# EAGLE design torque_sensor (EAGLE 9.6.0)
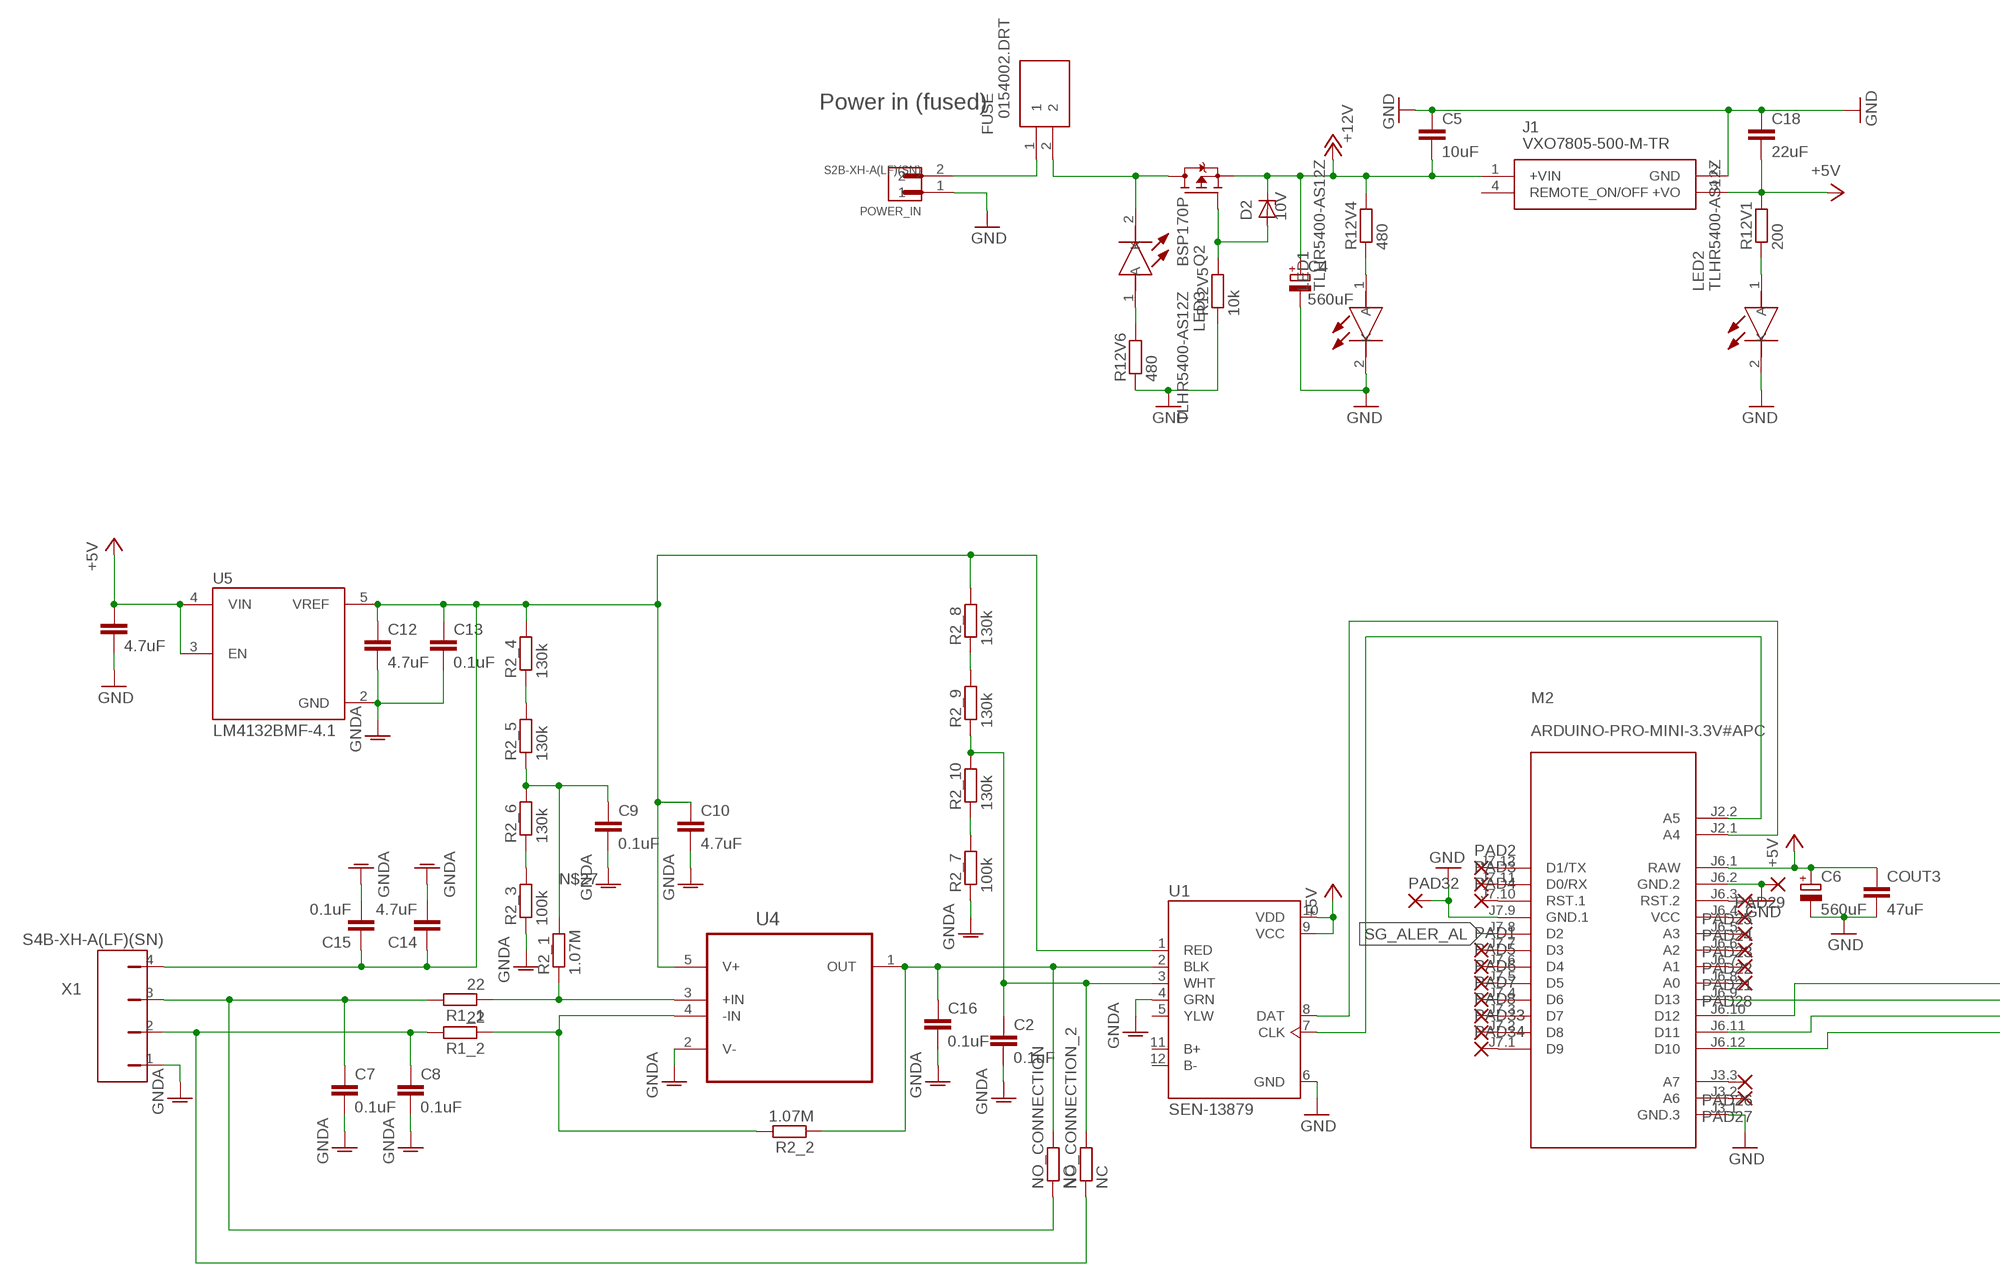
[diagram p0: schematic, sheet 1, part 1 of 2]
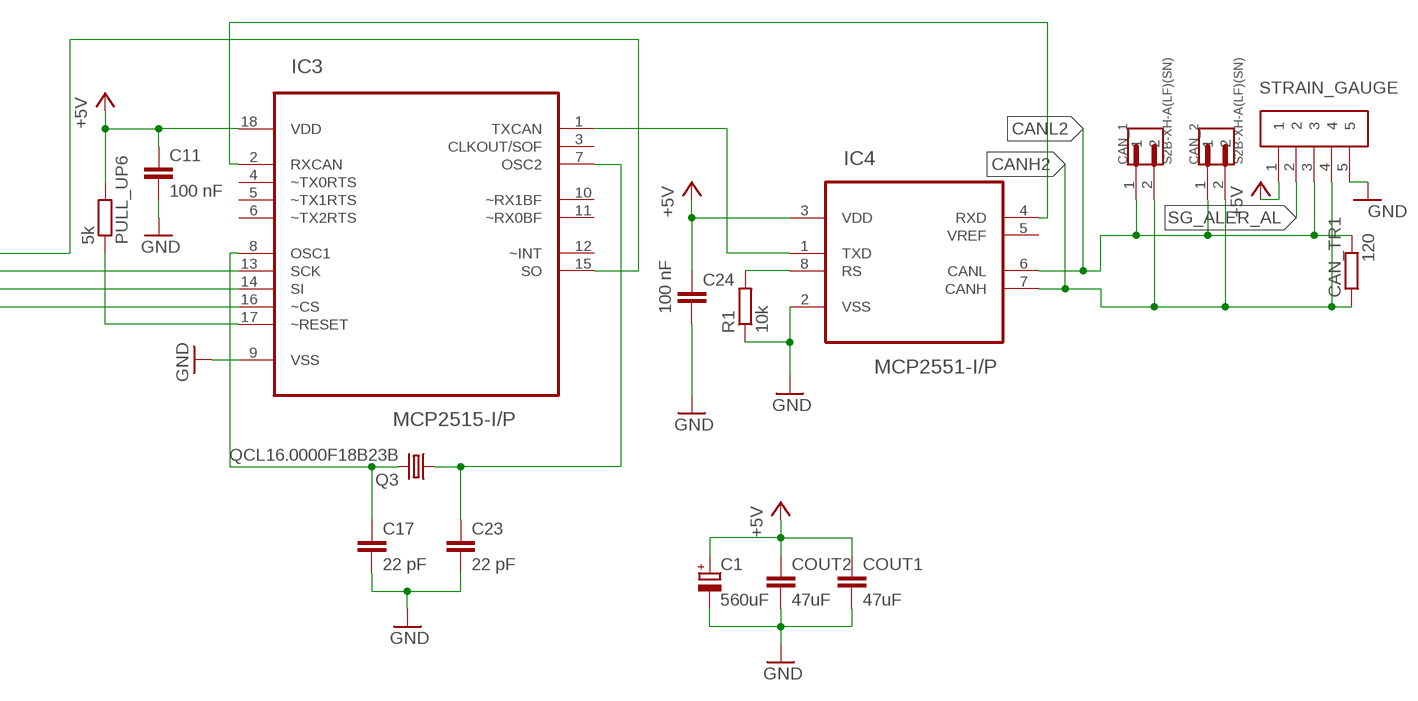
[diagram p1: schematic, sheet 1, part 2 of 2]

## Parts
C1  560uF  CPOL-EUF  [PANASONIC_F]
C2  0.1uF  C-EUC0805  [C0805]
C3  4.7uF  C-EUC0805  [C0805]
C4  560uF  CPOL-EUF  [PANASONIC_F]
C5  10uF  C-EUC0805  [C0805]
C6  560uF  CPOL-EUF  [PANASONIC_F]
C7  0.1uF  C-EUC0805  [C0805]
C8  0.1uF  C-EUC0805  [C0805]
C9  0.1uF  C-EUC0805  [C0805]
C10  4.7uF  C-EUC0805  [C0805]
C11  100 nF  C-EUC0805  [C0805]
C12  4.7uF  C-EUC0805  [C0805]
C13  0.1uF  C-EUC0805  [C0805]
C14  4.7uF  C-EUC0805  [C0805]
C15  0.1uF  C-EUC0805  [C0805]
C16  0.1uF  C-EUC0805  [C0805]
C17  22 pF  C-EUC0805  [C0805]
C18  22uF  C-EUC0805  [C0805]
C23  22 pF  C-EUC0805  [C0805]
C24  100 nF  C-EUC0805  [C0805]
CAN_1  S2B-XH-A(LF)(SN)  [JST_S2B-XH-A(LF)(SN)]
CAN_2  S2B-XH-A(LF)(SN)  [JST_S2B-XH-A(LF)(SN)]
CAN_TR1  120  R-EU_R0805  [R0805]
COUT1  47uF  C-EUC0805  [C0805]
COUT2  47uF  C-EUC0805  [C0805]
COUT3  47uF  C-EUC0805  [C0805]
D2  10V  ZENER-DIODESMB  [SMB]
FUSE  0154002.DRT  [FUSM9750X381N]
IC3  MCP2515-I/P  [DIP254P762X432-18]
IC4  MCP2551-I/P  [DIP254P762X432-8]
J1  VXO7805-500-M-TR  [VXO7805500MTR]
LED1  TLHR5400-AS12Z  [TLHR5400AS12Z]
LED2  TLHR5400-AS12Z  [TLHR5400AS12Z]
LED3  TLHR5400-AS12Z  [TLHR5400AS12Z]
M2  ARDUINO-PRO-MINI-3.3V#APC  [ARDUINO-PRO-MINI#APC]
NO_CONNECTION  NC  R-EU_R0805  [R0805]
NO_CONNECTION_2  NC  R-EU_R0805  [R0805]
PAD1  SMD2  [SMD1,27-2,54]
PAD2  SMD2  [SMD1,27-2,54]
PAD3  SMD2  [SMD1,27-2,54]
PAD4  SMD2  [SMD1,27-2,54]
PAD5  SMD2  [SMD1,27-2,54]
PAD6  SMD2  [SMD1,27-2,54]
PAD7  SMD2  [SMD1,27-2,54]
PAD8  SMD2  [SMD1,27-2,54]
PAD21  SMD2  [SMD1,27-2,54]
PAD22  SMD2  [SMD1,27-2,54]
PAD23  SMD2  [SMD1,27-2,54]
PAD24  SMD2  [SMD1,27-2,54]
PAD25  SMD2  [SMD1,27-2,54]
PAD26  SMD2  [SMD1,27-2,54]
PAD27  SMD2  [SMD1,27-2,54]
PAD28  SMD2  [SMD1,27-2,54]
PAD29  SMD2  [SMD1,27-2,54]
PAD32  SMD2  [SMD1,27-2,54]
PAD33  SMD2  [SMD1,27-2,54]
PAD34  SMD2  [SMD1,27-2,54]
POWER_IN  S2B-XH-A(LF)(SN)  [JST_S2B-XH-A(LF)(SN)]
PULL_UP6  5k  R-EU_R0805  [R0805]
Q2  BSP170P  [SOT223]
Q3  QCL16.0000F18B23B  CRYSTALHC49S  [HC49/S]
R1  10k  R-EU_R0805  [R0805]
R1_1  22  R-EU_R0805  [R0805]
R1_2  22  R-EU_R0805  [R0805]
R2_1  1.07M  R-EU_R0805  [R0805]
R2_2  1.07M  R-EU_R0805  [R0805]
R2_3  100k  R-EU_R0805  [R0805]
R2_4  130k  R-EU_R0805  [R0805]
R2_5  130k  R-EU_R0805  [R0805]
R2_6  130k  R-EU_R0805  [R0805]
R2_7  100k  R-EU_R0805  [R0805]
R2_8  130k  R-EU_R0805  [R0805]
R2_9  130k  R-EU_R0805  [R0805]
R2_10  130k  R-EU_R0805  [R0805]
R12V1  200  R-EU_R0805  [R0805]
R12V4  480  R-EU_R0805  [R0805]
R12V5  10k  R-EU_R0805  [R0805]
R12V6  480  R-EU_R0805  [R0805]
STRAIN_GAUGE  S5B-XH-A(LF)(SN)  [JST_S5B-XH-A(LF)(SN)]
U1  SEN-13879  [SPARKFUN_SEN-13879]
U4  LMP7731MF  [SOT95P284X119-5N]
U5  LM4132BMF-4.1  [SOT95P280X145-5N]
X1  S4B-XH-A(LF)(SN)  [S4B-XH-A(LF)(SN)]

## Nets
+5V [signal]: C1.+ C3.1 C6.+ C11.1 C18.2 C24.1 COUT1.1 COUT2.1 COUT3.1 IC3.18(VDD) IC4.3(VDD) J1.3(+VO) M2.J6.1(RAW) PULL_UP6.2 R12V1.2 STRAIN_GAUGE.1 U1.9(VCC) U1.10(VDD) U5.3(EN) U5.4(VIN)
+12V: C4.+ C5.2 D2.C J1.1(+VIN) Q2.3(S) R12V4.2
CANH2: CAN_1.2 CAN_2.2 CAN_TR1.1 IC4.7(CANH) STRAIN_GAUGE.4
CANL2: CAN_1.1 CAN_2.1 CAN_TR1.2 IC4.6(CANL) STRAIN_GAUGE.3
GND: C1.- C3.2 C4.- C5.1 C6.- C11.2 C17.2 C18.1 C23.2 C24.2 COUT1.2 COUT2.2 COUT3.2 IC3.9(VSS) IC4.2(VSS) J1.2(GND) LED1.2(K) LED2.2(K) M2.J3.1(GND.3) M2.J6.2(GND.2) M2.J7.9(GND.1) PAD29.1(P) PAD32.1(P) POWER_IN.1 R1.1 R12V5.1 R12V6.1 STRAIN_GAUGE.5 U1.6(GND)
GNDA: C2.2 C7.2 C8.2 C9.2 C10.2 C12.2 C13.2 C14.2 C15.2 C16.2 R2_3.1 R2_7.1 U1.4(GRN) U4.2(V-) U5.2(GND) X1.1
N$1: R2_8.1 R2_9.2
N$2: LED2.1(A) R12V1.1
N$3: LED1.1(A) R12V4.1
N$4: C16.1 NO_CONNECTION.2 R2_2.1 U1.2(BLK) U4.1(OUT)
N$5: R1_2.1 R2_2.2 U4.4(-IN)
N$6: M2.J7.12(D1/TX) PAD2.1(P)
N$7: D2.A Q2.1(G) R12V5.2
N$8: R2_7.2 R2_10.1
N$9: C10.1 C12.1 C13.1 C14.1 C15.1 R2_4.2 R2_8.2 U1.1(RED) U4.5(V+) U5.5(VREF) X1.4
N$11: M2.J7.7(D3) PAD1.1(P)
N$12: M2.J7.6(D4) PAD5.1(P)
N$13: M2.J7.5(D5) PAD6.1(P)
N$14: M2.J7.4(D6) PAD7.1(P)
N$15: R1_1.1 R2_1.1 U4.3(+IN)
N$16: LED3.1(A) R12V6.2
N$17: M2.J2.2(A5) U1.7(CLK)
N$18: M2.J7.3(D7) PAD8.1(P)
N$19: M2.J7.11(D0/RX) PAD3.1(P)
N$20: C2.1 NO_CONNECTION_2.2 R2_9.1 R2_10.2 U1.3(WHT)
N$21: M2.J2.1(A4) U1.8(DAT)
N$22: FUSE.1 POWER_IN.2
N$23: M2.J7.10(RST.1) PAD4.1(P)
N$24: FUSE.2 LED3.2(K) Q2.2(D) Q2.4(D)
N$25: M2.J6.7(A1) PAD21.1(P)
N$26: M2.J6.6(A2) PAD22.1(P)
N$27: C9.1 R2_1.2 R2_5.1 R2_6.2
N$28: M2.J6.5(A3) PAD23.1(P)
N$29: M2.J6.4(VCC) PAD24.1(P)
N$30: M2.J6.3(RST.2) PAD25.1(P)
N$31: M2.J3.3(A7) PAD26.1(P)
N$32: C8.1 NO_CONNECTION_2.1 R1_2.2 X1.2
N$34: M2.J7.2(D8) PAD33.1(P)
N$35: R2_4.1 R2_5.2
N$36: IC3.15(SO) M2.J6.10(D12)
N$37: IC3.13(SCK) M2.J6.9(D13)
N$38: IC3.14(SI) M2.J6.11(D11)
N$39: IC3.16(~CS) M2.J6.12(D10)
N$40: M2.J3.2(A6) PAD27.1(P)
N$41: M2.J6.8(A0) PAD28.1(P)
N$54: R2_3.2 R2_6.1
N$55: M2.J7.1(D9) PAD34.1(P)
N$56: IC3.17(~RESET) PULL_UP6.1
N$58: C17.1 IC3.8(OSC1) Q3.2
N$59: C23.1 IC3.7(OSC2) Q3.1
N$60: IC4.8(RS) R1.2
N$62: IC3.2(RXCAN) IC4.4(RXD)
N$68: IC3.1(TXCAN) IC4.1(TXD)
SG_ALER_AL: M2.J7.8(D2) STRAIN_GAUGE.2
VCCINT4: C7.1 NO_CONNECTION.1 R1_1.2 X1.3
Unconnected: IC3.3(CLKOUT/SOF) IC3.4(~TX0RTS) IC3.5(~TX1RTS) IC3.6(~TX2RTS) IC3.10(~RX1BF) IC3.11(~RX0BF) IC3.12(~INT) IC4.5(VREF) J1.4(REMOTE_ON/OFF) U1.5(YLW) U1.11(B+) U1.12(B-)

## Notes on the sheet
- Power in (fused)

## Library data of the parts
C1 C4 C6 = rcl:CPOL-EU: POLARIZED CAPACITOR, European symbol; SPICEPREFIX: C
C2 C3 C5 C7-C18 C23 C24 COUT1-COUT3 = rcl:C-EU: CAPACITOR, European symbol; SPICEPREFIX: C
CAN_1 CAN_2 POWER_IN = S2B-XH-A_LF__SN_:S2B-XH-A(LF)(SN): XH Series 2.5mm 2 Position Through Hole Shrouded Header Connector; DESCRIPTION: Connector Header Through Hole, Right Angle 2 position 0.098 _2.50mm_; DIGI-KEY_PART_NUMBER: 455-2257-ND; DIGI-KEY_PURCHASE_URL: https://www.digikey.com/product-detail/en/jst-sales-america-inc/S2B-XH-A_LF__SN_/455-2257-ND/1651055?utm_source=snapeda&utm_medium=aggregator&utm_campaign=symbol; MF: JST Sales; MP: S2B-XH-A_LF__SN_; PACKAGE: None
CAN_TR1 NO_CONNECTION NO_CONNECTION_2 PULL_UP6 R1 R1_1 R1_2 R2_1-R2_10 R12V1 R12V4-R12V6 = rcl:R-EU_: RESISTOR, European symbol; SPICEPREFIX: R
D2 = diode:ZENER-DIODE: Z-Diode
FUSE = 0154002.DRT:0154002.DRT: Littelfuse 2A T Surface Mount Fuse, 125V ac/dc Source: Datasheet; DESCRIPTION: Littelfuse 2A T Surface Mount Fuse, 125V ac/dc; HEIGHT: 3.81mm; MANUFACTURER_NAME: LITTELFUSE; MANUFACTURER_PART_NUMBER: 0154002.DRT; MOUSER_PART_NUMBER: 576-0154002.DRT; MOUSER_PRICE-STOCK: https://www.mouser.co.uk/ProductDetail/Littelfuse/0154002DRT?qs=2VFNtWizgicDQ8R7JxIsmA%3D%3D
IC3 = MCP2515-I_P:MCP2515-I/P: Stand-Alone CAN Controller; AVAILABILITY: Unavailable; DESCRIPTION: MCP2515 Series 5.5 V 1 Mb/s Stand Alone SPI Interface CAN Controller - PDIP-18; MF: Microchip; MP: MCP2515-I/P; PACKAGE: DIP-18 Microchip; PRICE: None
IC4 = MCP2551-I_P:MCP2551-I/P: High-Speed CAN Transceiver; AVAILABILITY: Unavailable; DESCRIPTION: MCP2551 Series 5.5 V 1 Mb/s Surface Mount High-Speed CAN Transceiver - PDIP-8; MF: Microchip; MP: MCP2551-I/P; PACKAGE: DIP-8 Microchip; PRICE: None
J1 = VXO7805-500-M-TR:VXO7805-500-M-TR: Module DC-DC 24VIN 1-OUT 5V 0.5A 2.5W 4-Pin SMD Module T/R Source: Datasheet; DESCRIPTION: Module DC-DC 24VIN 1-OUT 5V 0.5A 2.5W 4-Pin SMD Module T/R; HEIGHT: 3.5mm; MANUFACTURER_NAME: CUI Inc; MANUFACTURER_PART_NUMBER: VXO7805-500-M-TR; MOUSER_PART_NUMBER: 490-VXO7805-500-M-TR; MOUSER_PRICE-STOCK: https://www.mouser.co.uk/ProductDetail/CUI-Inc/VXO7805-500-M-TR?qs=GBLSl2AkirsIOUn2Flq1hQ%3D%3D
LED1-LED3 = SamacSys_Parts:TLHR5400-AS12Z: Standard LEDs - Through Hole Red 10mcd; 5mm 612-625nm; 2V Typ Source: Datasheet <http://www.vishay.com/docs/83012/tlhg540.pdf>; DESCRIPTION: Standard LEDs - Through Hole Red 10mcd; 5mm 612-625nm; 2V Typ; HEIGHT: 12.8mm; MANUFACTURER_NAME: Vishay; MANUFACTURER_PART_NUMBER: TLHR5400-AS12Z; MOUSER_PART_NUMBER: 78-TLHR5400-AS12Z; MOUSER_PRICE-STOCK: https://www.mouser.co.uk/ProductDetail/Vishay-Semiconductors/TLHR5400-AS12Z?qs=nQ9vpdMXC6Dc4iRzpr4t7Q%3D%3D
M2 = diy-modules:ARDUINO-PRO-MINI-*#APC: Arduino Pro Mini (and compatible devices) with angle programming connector More details available here: https://www.arduino.cc/en/Main/ArduinoBoardProMini Click here to find device on ebay.com <http://www.ebay.com/sch/arduino+pro+mini>
PAD1-PAD8 PAD21-PAD29 PAD32-PAD34 = wirepad:SMD2: SMD PAD
Q2 = transistor-fet:BSP170P: SIPMOS(R) Small-Signal-Transistor P-Channel, Enhancement mode Source: http://www.infineon.com/upload/Document/BSP170P_Rev2.4.pdf
Q3 = adafruit:CRYSTAL: CRYSTAL; OC_FARNELL: 1667008; OC_NEWARK: unknown
STRAIN_GAUGE = S5B-XH-A_LF__SN_:S5B-XH-A(LF)(SN): XH Connector 2.5mm pitch/Disconnectable Crimp Style Connector; AVAILABILITY: Unavailable; DESCRIPTION: Connector Header Through Hole, Right Angle 5 position 0.098 _2.50mm_; MF: JST Sales; MP: S5B-XH-A_LF__SN_; PACKAGE: None; PRICE: None
U1 = SEN-13879:SEN-13879: Load Cell Amp Hx711; DESCRIPTION: External Input Sensor Amplifier; DIGI-KEY_PART_NUMBER: 1568-1436-ND; DIGI-KEY_PURCHASE_URL: https://www.digikey.com/product-detail/en/sparkfun-electronics/SEN-13879/1568-1436-ND/6202732?utm_source=snapeda&utm_medium=aggregator&utm_campaign=symbol; MF: SparkFun; MP: SEN-13879; PACKAGE: None
U4 = LMP7731MF:LMP7731MF: Amplifier; AVAILABILITY: Unavailable; DESCRIPTION: Ic Amp Prec Rrio Ln Sgl Sot23-5 - Lmp7731mf/Nopb; MF: Texas Instruments; MP: LMP7731MF; PACKAGE: SOT-23 Texas Instruments; PRICE: None
U5 = LM4132BMF-4.1:LM4132BMF-4.1: Voltage Reference, Precision, Low Dropout, Series - Fixed, LM4132 Series, 4.096V, SOT-23-5; AVAILABILITY: Unavailable; DESCRIPTION: Series Voltage Reference IC ±0.1% SOT-23-5; MF: Texas Instruments; MP: LM4132BMF-4.1; PACKAGE: SOT-23 Texas Instruments; PRICE: None
X1 = S4B-XH-A_LF__SN_:S4B-XH-A(LF)(SN): http://octopart.com/s4b-xh-a%28lf%29%28sn%29-jst-7995347; AVAILABILITY: Unavailable; DESCRIPTION: Connector Header Through Hole, Right Angle 4 position 0.098 _2.50mm_; MF: JST Sales; MP: S4B-XH-A_LF__SN_; PACKAGE: None; PRICE: None

## Net classes
1 signal: width 0.3 mm, drill 0.4 mm, clearance 0.25 mm
2 12V: width 1 mm, drill 1.1 mm, clearance 0.25 mm

## Board
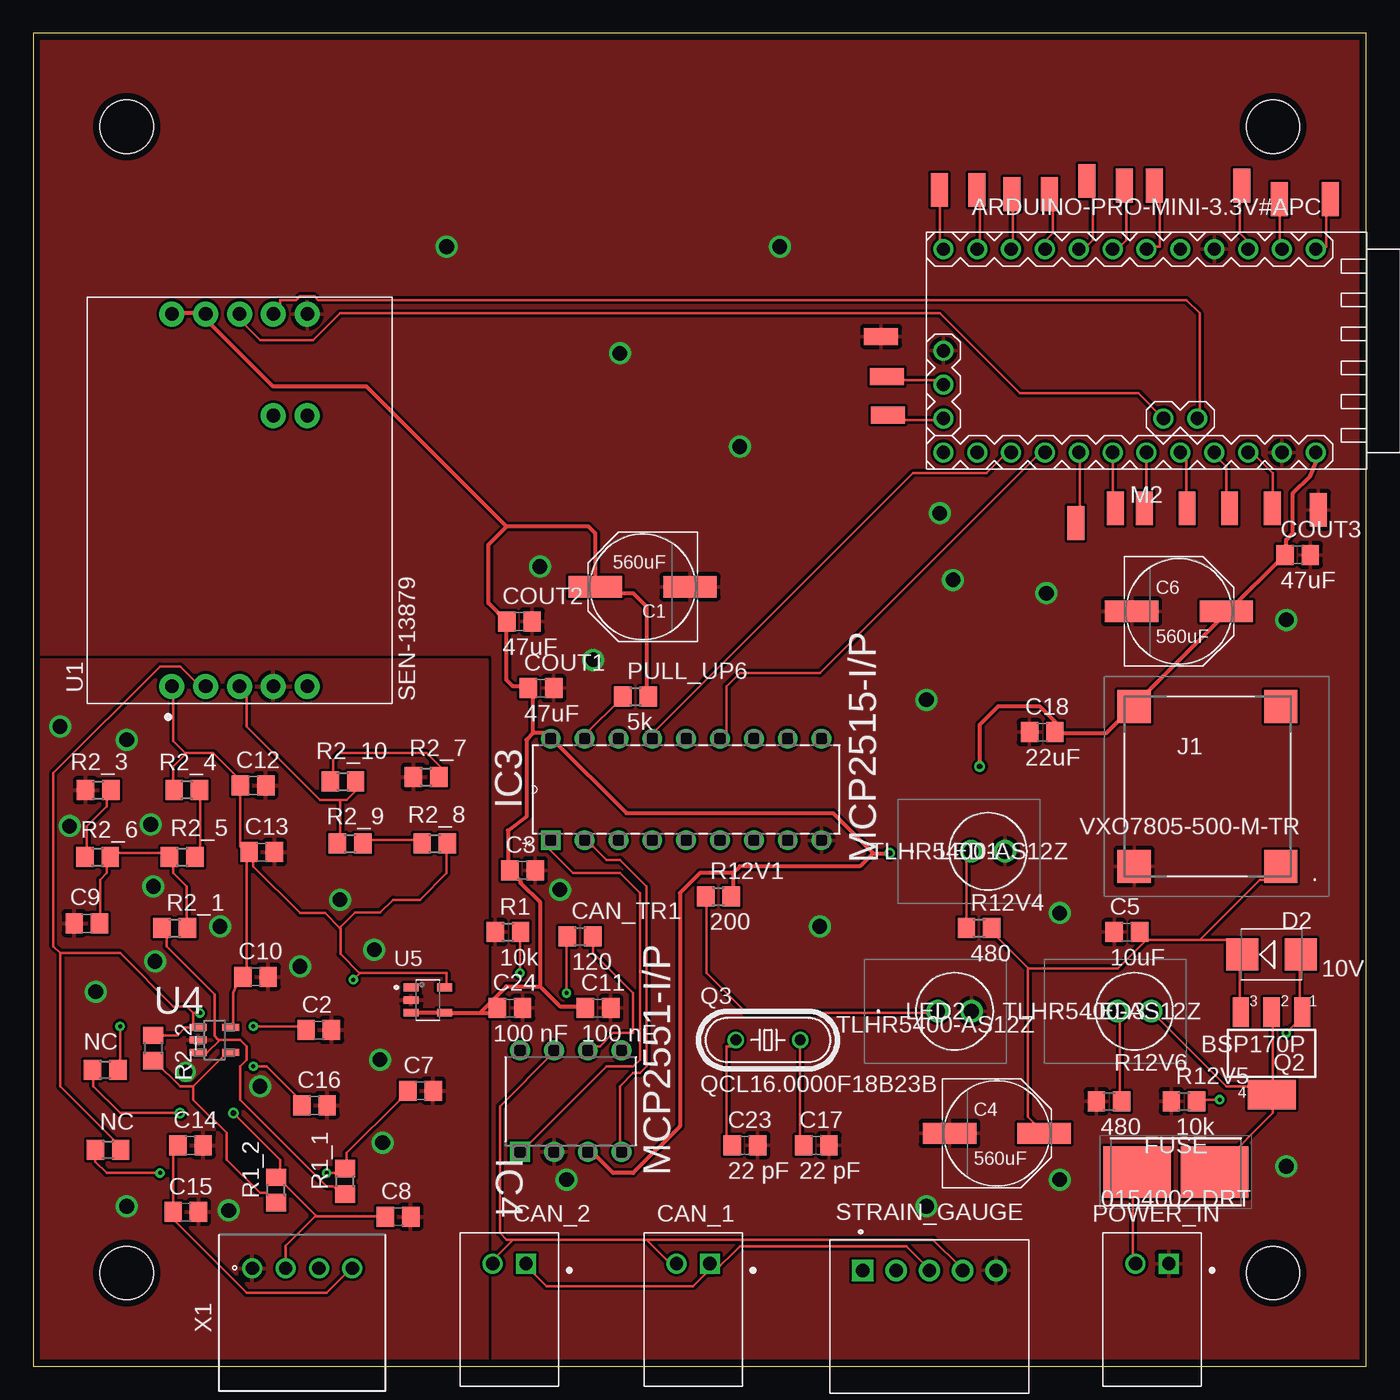
[diagram p2: board, top side]
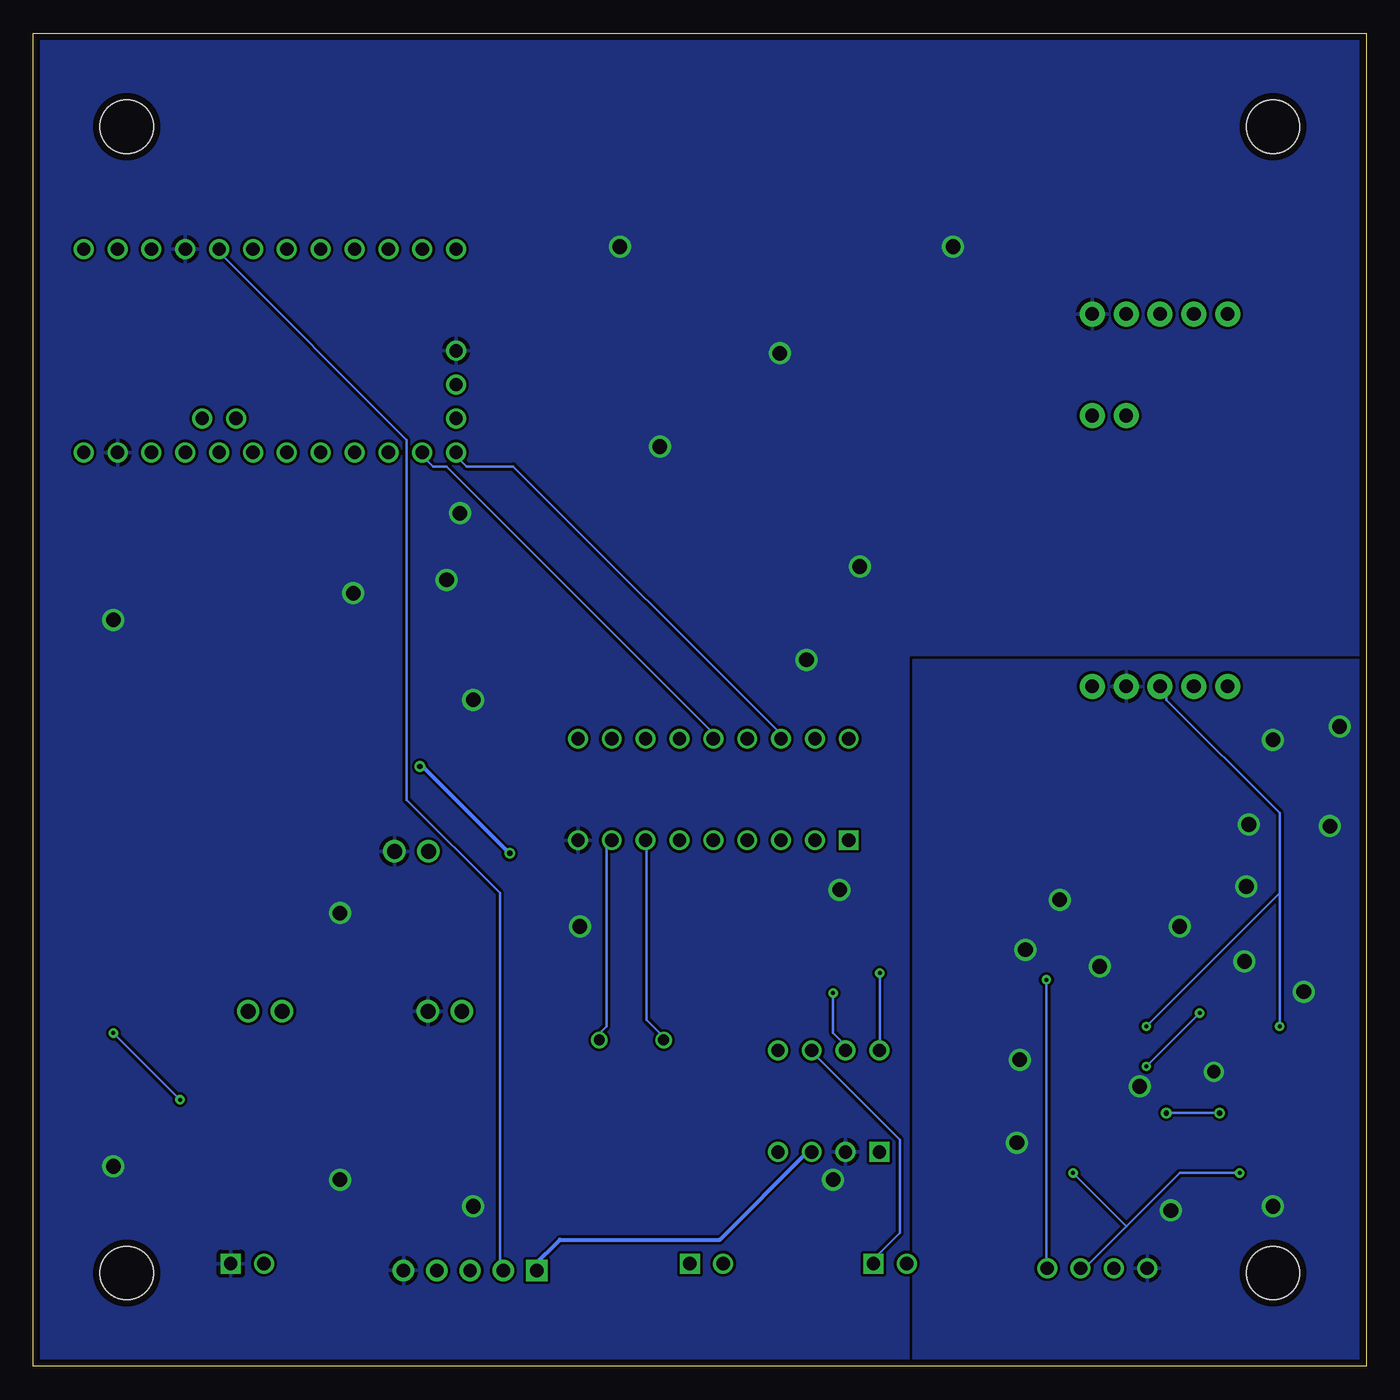
[diagram p3: board, bottom side, seen from below]

Size 100 x 100 mm. Coordinates in mm from the lower left corner, seen from the top.
Outline: 0,0 100,0 100,100 0,100 0,0
Copper layers (1*16): Top 0.035mm / dielectric 1.5mm / Bottom 0.035mm
Design rules "JLC_Vermilion2020": minimum track width 0.2mm, minimum drill 0.3mm, track to track 0.2mm, track to pad 0.3mm, pad to pad 0.3mm, via to via 0.2mm, smd to smd 0.2mm, copper to edge 0.5mm, drill to drill 0.25mm, minimum pad ring 0.2mm, minimum via ring 0.2mm, stop-mask expansion 0.055mm, vias tented up to drill 0.3mm, thermal gap 0.3mm
Holes 4 mm at 7,7 93,7 93,93 7,93

### Footprints (pad centres in the part's own frame; a part is rotated, then mirrored left to right if it is on the bottom)
PANASONIC_F = smd 4 x 1.6: + 3.55,0; - -3.55,0
C0805 = smd 1.3 x 1.5: 1 -0.95,0; 2 0.95,0
JST_S2B-XH-A(LF)(SN) = drill 1 square: 1 -1.25,0 | drill 1: 2 1.25,0
R0805 = smd 1.3 x 1.5: 1 -0.95,0; 2 0.95,0
SMB = smd 2.4 x 2.4: A 2.2,0; C -2.2,0
FUSM9750X381N = smd 5.05 x 3.85: 1 -2.9,0; 2 2.9,0
DIP254P762X432-18 = drill 0.991 square: 1 -7.62,20.32 | drill 0.991: 2 -7.62,17.78; 3 -7.62,15.24; 4 -7.62,12.7; 5 -7.62,10.16; 6 -7.62,7.62; 7 -7.62,5.08; 8 -7.62,2.54; 9 -7.62,0; 10 0,0; 11 0,2.54; 12 0,5.08; 13 0,7.62; 14 0,10.16; 15 0,12.7; 16 0,15.24; 17 0,17.78; 18 0,20.32
DIP254P762X432-8 = drill 0.991 square: 1 -7.62,7.62 | drill 0.991: 2 -7.62,5.08; 3 -7.62,2.54; 4 -7.62,0; 5 0,0; 6 0,2.54; 7 0,5.08; 8 0,7.62
VXO7805500MTR = smd 2.5 x 2.5: 1 -5.5,6; 2 5.5,6; 3 5.5,-6; 4 -5.5,-6
TLHR5400AS12Z = drill 1.12 pad 1.68: 1 0,0; 2 2.54,0
ARDUINO-PRO-MINI#APC = drill 1: J2.1 -1.27,5.08; J2.2 -3.81,5.08; J3.1 15.24,0; J3.2 15.24,2.54; J3.3 15.24,5.08; J6.1 -12.7,7.62; J6.2 -10.16,7.62; J6.3 -7.62,7.62; J6.4 -5.08,7.62; J6.5 -2.54,7.62; J6.6 0,7.62; J6.7 2.54,7.62; J6.8 5.08,7.62; J6.9 7.62,7.62; J6.10 10.16,7.62; J6.11 12.7,7.62; J6.12 15.24,7.62; J7.1 15.24,-7.62; J7.2 12.7,-7.62; J7.3 10.16,-7.62; J7.4 7.62,-7.62; J7.5 5.08,-7.62; J7.6 2.54,-7.62; J7.7 0,-7.62; J7.8 -2.54,-7.62; J7.9 -5.08,-7.62; J7.10 -7.62,-7.62; J7.11 -10.16,-7.62; J7.12 -12.7,-7.62
SMD1,27-2,54 = smd 1.27 x 2.54: 1 0,0
SOT223 = smd 1.219 x 2.235: 1 -2.311,-3.099; 2 0,-3.099; 3 2.311,-3.099 | smd 3.6 x 2.2: 4 0,3.099
HC49/S = drill 0.813: 1 -2.413,0; 2 2.413,0
JST_S5B-XH-A(LF)(SN) = drill 1 pad 1.59 square: 1 -5,0 | drill 1 pad 1.59: 2 -2.5,0; 3 0,0; 4 2.5,0; 5 5,0
SPARKFUN_SEN-13879 = drill 1.016 pad 1.88: 1 -13.97,5.08; 2 -13.97,2.54; 3 -13.97,0; 4 -13.97,-2.54; 5 -13.97,-5.08; 6 13.97,-5.08; 7 13.97,-2.54; 8 13.97,0; 9 13.97,2.54; 10 13.97,5.08; 11 6.35,-2.54; 12 6.35,-5.08
SOT95P284X119-5N = smd 1.27 x 0.533: 1 -1.219,0.94; 2 -1.219,0; 3 -1.219,-0.94; 4 1.219,-0.94; 5 1.219,0.94
SOT95P280X145-5N = smd 1.21 x 0.59: 1 -1.255,0.95; 2 -1.255,0; 3 -1.255,-0.95; 4 1.255,-0.95; 5 1.255,0.95
S4B-XH-A(LF)(SN) = drill 1: 1 -0.02,3.75; 2 -0.02,1.25; 3 -0.02,-1.25; 4 -0.02,-3.75

### Placement (x,y rotation side)
C1  45.72,58.47 180 top
C2  21.42,25.22 0 top
C3  36.7,37.2 0 top
C4  72.29,17.47 0 top
C5  82.04,32.57 0 top
C6  85.95,56.63 0 top
C7  29.06,20.67 0 top
C8  27.37,11.22 0 top
C9  4.02,33.22 180 top
C10  16.67,29.22 0 top
C11  42.37,26.87 0 top
C12  16.49,43.57 0 top
C13  17.14,38.57 0 top
C14  11.79,16.57 0 top
C15  11.44,11.57 0 top
C16  21.09,19.57 0 top
C17  58.74,16.57 0 top
C18  75.69,47.57 0 top
C23  53.39,16.57 0 top
C24  35.75,26.87 0 top
CAN_1  49.5,7.69 180 top
CAN_2  35.72,7.69 180 top
CAN_TR1  41.02,32.25 0 top
COUT1  38.09,50.87 0 top
COUT2  36.47,55.87 0 top
COUT3  94.85,60.87 0 top
D2  92.9,30.89 0 top
FUSE  85.72,14.57 0 top
IC3  59.14,47.08 90 top
IC4  44.14,23.69 90 top
J1  88.09,43.5 180 top
LED1  70.36,38.63 0 top
LED2  67.85,26.63 0 top
LED3  81.34,26.63 0 top
M2  83.52,76.18 180 top
NO_CONNECTION  5.61,16.25 0 top
NO_CONNECTION_2  5.39,22.25 0 top
PAD1  84.1,88.57 0 top
PAD2  97.29,87.57 0 top
PAD3  93.48,87.57 0 top
PAD4  90.67,88.57 0 top
PAD5  81.86,88.57 0 top
PAD6  79.03,88.92 0 top
PAD7  76.22,87.92 0 top
PAD8  73.41,87.92 0 top
PAD21  81.18,64.36 0 top
PAD22  83.37,64.36 0 top
PAD23  86.56,64.36 0 top
PAD24  89.75,64.36 0 top
PAD25  92.94,64.36 0 top
PAD26  64.13,71.36 90 top
PAD27  64.03,74.25 90 top
PAD28  78.22,63.25 0 top
PAD29  96.41,64.25 0 top
PAD32  63.6,77.25 90 top
PAD33  70.79,88.25 0 top
PAD34  67.98,88.25 0 top
POWER_IN  83.94,7.69 180 top
PULL_UP6  45.18,50.25 0 top
Q2  92.9,23.47 180 top
Q3  55.12,24.47 0 top
R1  35.61,32.57 0 top
R1_1  23.4,13.87 90 top
R1_2  18.22,13.22 90 top
R2_1  10.61,32.87 0 top
R2_2  8.99,23.87 270 top
R2_3  4.87,43.22 0 top
R2_4  11.52,43.22 180 top
R2_5  11.17,38.22 0 top
R2_6  4.82,38.22 0 top
R2_7  29.47,44.22 0 top
R2_8  30.12,39.22 0 top
R2_9  23.77,39.22 0 top
R2_10  23.23,43.87 0 top
R12V1  51.4,35.25 0 top
R12V4  70.95,32.87 0 top
R12V5  86.33,19.87 0 top
R12V6  80.71,19.87 0 top
STRAIN_GAUGE  67.23,7.18 0 top
U1  15.47,64.97 90 top
U4  13.6,24.47 0 top
U5  29.61,27.47 0 top
X1  20.18,7.37 90 top

### Tracks (layer width: path | path; a pad name or v marks a point on that pad's centre or on a via)
+5V  (via drill 0.4)
  Top 0.3: U5.3 28.5,26.5 30.5,26.5 U5.4 31,26.5 33.5,26.5 | 33.5,26.5 34.5,26.5 C24.1 | 38,28.5 39.5,27 41,27 C11.1 | 38,28.5 35.5,28.5 33.5,26.5 | 37.5,47.5 37.5,50.5 COUT1.1 37,51 36,51 35.5,51.5 35.5,55.5 COUT2.1 34.14,57.25 34.14,61.63 35.5,63 | 37.5,47.5 38.5,47.5 IC3.18 39,47 44.5,41.5 60,41.5 63,38.5 62.98,38.48 | U1.10 10.5,79 12.5,79 U1.9 13,78.5 18,73.5 25,73.5 35.5,63 | PULL_UP6.2 46,50.5 46,57 45,58 42.5,58 C1.+ 42.17,62.47 41.64,63 35.5,63 | 37.5,47.5 37,47 37,41.23 35.61,40.2 35.61,37.35 C3.1 36.55,36.4 36.55,36.27 38,34.82 38,28.5 | M2.J6.1 96.5,68.5 95.79,66.79 94.5,65.5 94.5,62.5 94,62 94,61 COUT3.1 93.5,60.5 90,57 89.5,57 C6.+ 89.5,56.5 82.5,49.5 | 52.5,37 53,37.5 62,37.5 62.98,38.48 | 52.5,37 52.5,35.5 R12V1.2 | 82.5,49.5 80.5,47.5 77,47.5 C18.2 77,48 75.47,49.53 72.39,49.53 71,48.14 v71,45 | 82.5,49.5 J1.3 | 52.5,37 50,37 48.5,35.5 48.5,18 45,14.5 43.5,14.5 42,16 IC4.3 | 62.98,38.48 v64.26,38.48
  Bottom 0.3: IC4.3 42,16 48.5,9.5 60.5,9.5 62.5,7.5 STRAIN_GAUGE.1 | v64.26,38.48 70.78,45 v71,45
+12V
  Top 0.2: 83.5,32 83,32.5 C5.2 83.5,32 | 87.5,32 89.5,32 90.5,31 D2.C 90.5,30.5 90.5,27 Q2.3 | 87.5,32 83.5,32 | 74.6,29.86 81.36,29.86 83.5,32 | 74.6,29.86 74.6,29.9 72,32.5 R12V4.2 | 87.5,32 92,36.5 92.5,36.5 93.5,37.5 J1.1 | 74.6,29.86 74.6,18.71 C4.+
CANH2  (via drill 0.3)
  Top 0.2: v40,28 40,32 CAN_TR1.1 | 36,9.5 34.5,8 CAN_2.2 | 46,9.5 36,9.5 | 46,9.5 47.5,8 48,8 CAN_1.2 | 46,9.5 67.5,9.5 69.5,7.5 STRAIN_GAUGE.4 | 36,9.5 35.5,9.5 35,10 35,19.5 39,23.5 IC4.7
  Bottom 0.2: v40,28 40,25 39,24 IC4.7
CANL2
  Top 0.2: CAN_TR1.2 42,32 42,31 45,28 45,25 43.5,25 42.5,24 42,24 IC4.6 | 50.5,7 51,7.5 CAN_1.1 50.5,7 | 50.5,7 49.5,6 38.5,6 37,7.5 CAN_2.1 | 50.5,7 51,7 53,9 65.5,9 67,7.5 STRAIN_GAUGE.3
  Bottom 0.2: IC4.6 41.5,23.5 35,17 35,10 37,8 CAN_2.1
GND  (via drill 1.1)
  other vias: 40,14 67,12 77,14 94,15 39.51,35.75 59,33 77,34 67,50 94,56 76,58 69,59 68,64 42,53 38,60 53,69 44,76 56,84 31,84
  pour Top (rank 2): -2,102 -2,-3 -3,-4 107,-4 108,-5 108,104 104,108 4,108
  pour Bottom (rank 2): -2,106 -2,-6 0,-8 104,-8 107,-5 108,-4 108,106
GNDA  (via drill 1, 1.1)
  other vias: 2,48 7,47 23,35 25.57,31.24 9,36 14,33 9.13,30.36 20,30 26,23 4.68,28.1 2.71,40.51 8.81,40.64 17,21 26.21,16.76 14.65,11.68 7,12 11.43,22.1
  pour Bottom: -3,53 34,53 34,-7 -8,-7 -13,-2 -13,43
  pour Top: -3,53 34,53 34,-2 33,-3 -2,-3 -4,-1 -4,52
N$1
  Top 0.2: R2_9.2 25,39.5 29,39.5 R2_8.1
N$2
  Top 0.2: R12V1.1 50.5,35 50.5,29.5 53.5,26.5 67.5,26.5 LED2.1
N$3
  Top 0.2: R12V4.1 70,38.5 LED1.1
N$4  (via drill 0.3)
  Top 0.2: 12,26.5 11.5,27 10.5,27 6.5,31 2,31 | 12,26.5 12,25.5 U4.1 11.41,25.41 10.82,24.82 R2_2.1 | 2,31 2,21 6.5,16.5 NO_CONNECTION.2 | v16.5,22.5 17.5,22.5 20,20 C16.1 | 12,26.5 v12.5,26.5 | 2,31 1.5,31.5 1.5,44.5 9.5,52.5 11,52.5 12.5,51 U1.2
  Bottom 0.2: v12.5,26.5 v16.5,22.5
N$5
  Top 0.2: R1_2.1 18,12.5 17.5,13 17,13 14.5,15.5 14.5,17.5 12,20 12,21 | R2_2.2 9.08,22.92 11,21 12,21 | U4.4 14.79,23.5 14.5,23.5 12,21
N$6
  Top 0.2: PAD2.1 97,87.5 97,84 96.5,84 M2.J7.12
N$7  (via drill 0.3)
  Top 0.2: v89,20 87.5,20 R12V5.2 | v94,25 95.5,26.5 Q2.1 95,27 95,30.5 D2.A
  Bottom 0.2: v94,25 v89,20
N$8
  Top 0.2: R2_10.1 22.5,44 22.5,45.5 23,46 29.5,46 31,44.5 31,44 30.5,44 R2_7.2
N$9  (via drill 0.3)
  Top 0.2: C14.1 10.5,16.5 10.5,12 C15.1 10,11.5 16,5.5 22,5.5 23.5,7 X1.4 | 11.5,46 11.4,46 10.5,46.9 10.5,51 U1.1 | R2_4.2 10.5,43.5 10.5,45 11.5,46 | 11.5,46 13.5,46 15.5,44 C12.1 15.5,43.5 15.5,39 16,39 C13.1 | U4.5 15,25.5 15,28 15.35,28.85 C10.1 16,29.5 16,38.5 C13.1 | C13.1 16.5,38.5 16.5,37.5 20,34 21.88,34 22.99,32.89 23.05,32.95 | R2_8.2 31,39 31,37 29,35 27,35 26.04,34.03 24.13,34.03 23.05,32.95 | 24.49,29.49 24.5,29.5 31,29.5 31,28.5 U5.5 | 24.49,29.49 v24,29 | 24.49,29.49 23.05,30.93 23.05,32.95
  Bottom 0.2: v24,29 24,7.5 X1.4
N$11
  Top 0.2: PAD1.1 84.5,88.5 84.5,84 84,84 M2.J7.7
N$12
  Top 0.2: PAD5.1 82,88.5 82,84.5 81.5,84 81,84 M2.J7.6
N$13
  Top 0.2: PAD6.1 79.5,88.5 79.5,84.5 79,84 78.5,84 M2.J7.5
N$14
  Top 0.2: PAD7.1 76.5,87.5 76.5,85 75.5,84 M2.J7.4
N$15
  Top 0.2: R2_1.1 10,32.5 10,31.5 13.59,27.91 13.59,24.78 13.87,24.5 14,24.5 | 14,24.5 15.5,24.5 16,24 16,23 15.5,22.5 15.5,20 22,13.5 22.5,13.5 23,13 R1_1.1 | U4.3 13.03,23.53 14,24.5
N$16
  Top 0.2: R12V6.2 81.5,20 81.5,26.5 LED3.1
N$17
  Top 0.2: M2.J2.2 87.5,71.5 87.5,79 86.5,80 21.39,80 21.11,80.28 20,80.28 19.71,80 18.5,80 18.5,79 U1.7
N$18
  Top 0.2: PAD8.1 73.5,87.5 73.5,84 M2.J7.3
N$19
  Top 0.2: PAD3.1 93.5,87.5 93.5,84 M2.J7.11
N$20  (via drill 0.3)
  Top 0.2: v6.5,25.5 6.5,22.5 NO_CONNECTION_2.2 | 23,42.5 23,39.5 R2_9.1 | 23,42.5 23.5,42.5 24.5,43.5 R2_10.2 | 23,42.5 21.5,42.5 16,48 16,51 U1.3 | v16.5,25.5 20,25.5 C2.1
  Bottom 0.2: 6.5,35.5 6.5,41.5 15,50 15,51 U1.3 | 6.5,35.5 v6.5,25.5 | 6.5,35.5 v16.5,25.5
N$21
  Top 0.2: M2.J2.1 82.89,73 74,73 68,79 23,79 21,77 17,77 15.5,78.5 U1.8
N$22
  Top 0.2: POWER_IN.2 82.5,8 82.5,14.5 FUSE.1
N$23
  Top 0.2: PAD4.1 90.5,88.5 90.5,85 91.5,84 M2.J7.10
N$24
  Top 0.2: 93,21 93,20.5 Q2.4 | 93,21 93,26.5 Q2.2 | 93,21 89.5,21 84,26.5 LED3.2 | 93,21 Q2.4 | FUSE.2 89,15 93,19 93,20 Q2.4
N$25
  Top 0.2: PAD21.1 81,64.5 81,68.5 M2.J6.7
N$26
  Top 0.2: PAD22.1 83.5,64.5 83.5,68.5 M2.J6.6
N$27
  Top 0.2: C9.1 5,33.5 5,36.5 5.5,37 5.5,38 R2_6.2 6,38.5 10,38.5 R2_5.1 10.5,38 10.5,37 11.5,36 11.5,33 R2_1.2
N$28
  Top 0.2: PAD23.1 86.5,64.5 86.5,68.5 M2.J6.5
N$29
  Top 0.2: PAD24.1 89.5,64.5 89.5,67.5 88.5,68.5 M2.J6.4
N$30
  Top 0.2: PAD25.1 93,64.5 93,67 91.5,68.5 M2.J6.3
N$31
  Top 0.2: PAD26.1 64.5,71 68,71 M2.J3.3
N$32  (via drill 0.4)
  Top 0.2: 21.21,11.25 21.14,11.25 18.93,9.03 X1.2 | C8.1 26.39,11.25 21.21,11.25 | NO_CONNECTION_2.1 4.5,22 4.5,21 6.5,19 v11,19 | 21.21,11.25 21.21,11.29 18.5,14 R1_2.2 18.5,14.5 18.5,15.5 v15,19
  Bottom 0.2: v11,19 v15,19
N$34
  Top 0.2: PAD33.1 71,88 71,84 M2.J7.2
N$35
  Top 0.2: R2_5.2 12.5,38.5 12.5,43 R2_4.1
N$36
  Top 0.2: IC3.15 46.5,47.5 66,67 71.5,67 73,68.5 M2.J6.10
N$37
  Top 0.2: IC3.13 52,47.5 52,51 53,52 59,52 75.5,68.5 M2.J6.9
N$38
  Bottom 0.2: IC3.14 49,47.5 69,67.5 70,67.5 71,68.5 M2.J6.11
N$39
  Bottom 0.2: IC3.16 44,47.5 64,67.5 67.5,67.5 68.5,68.5 M2.J6.12
N$40
  Top 0.2: PAD27.1 64.5,74 68,74 M2.J3.2
N$41
  Top 0.2: PAD28.1 78.5,63.5 78.5,68.5 M2.J6.8
N$54
  Top 0.2: R2_6.1 4,38.5 4,40.5 5.5,42 5.5,43 R2_3.2
N$55
  Top 0.2: PAD34.1 68,88 68,84 M2.J7.1
N$56
  Top 0.2: PULL_UP6.1 44,50 41.5,47.5 IC3.17
N$58
  Top 0.2: C17.1 57.5,17 57.5,24 Q3.2
  Bottom 0.2: IC3.8 57,39 57,25.5 58,24.5 Q3.2
N$59
  Top 0.2: C23.1 52,17 52,24 52.5,24 Q3.1
  Bottom 0.2: IC3.7 54,39 54,26 52.5,24.5 Q3.1
N$60  (via drill 0.3)
  Top 0.2: v36.5,29.5 36.5,32.5 R1.2
  Bottom 0.2: v36.5,29.5 36.5,24 IC4.8
N$62
  Top 0.2: IC4.4 44,16.5 44,21 45,22 45.5,22 46,22.5 46,36 44,38 43,38 42,39 41.5,39 IC3.2
N$68
  Top 0.2: IC4.1 37,16.5 43,22.5 45,22.5 45.5,23 45.5,35.5 44,37 40.5,37 38.5,39 IC3.1
SG_ALER_AL
  Bottom 0.2: M2.J7.8 86,83.5 72,69.5 72,42.5 65,35.5 65,7.5 STRAIN_GAUGE.2
VCCINT4  (via drill 0.3)
  Top 0.2: C7.1 27.47,20.03 27.5,20 23.5,16 23.5,15 R1_1.2 23,14.5 v22,14.5 | v9.5,14.5 5.5,14.5 4.66,15.34 NO_CONNECTION.1
  Bottom 0.2: v9.5,14.5 14,14.5 18,10.5 | 18,10.5 21,7.5 X1.3 | 18,10.5 v22,14.5